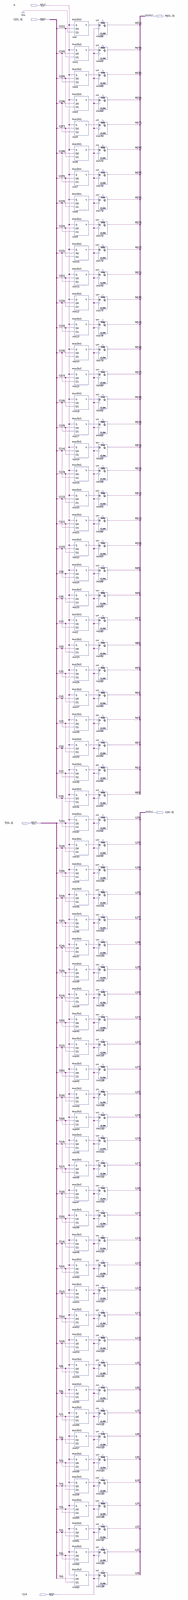
[diagram p0: schematic sheet, whole]
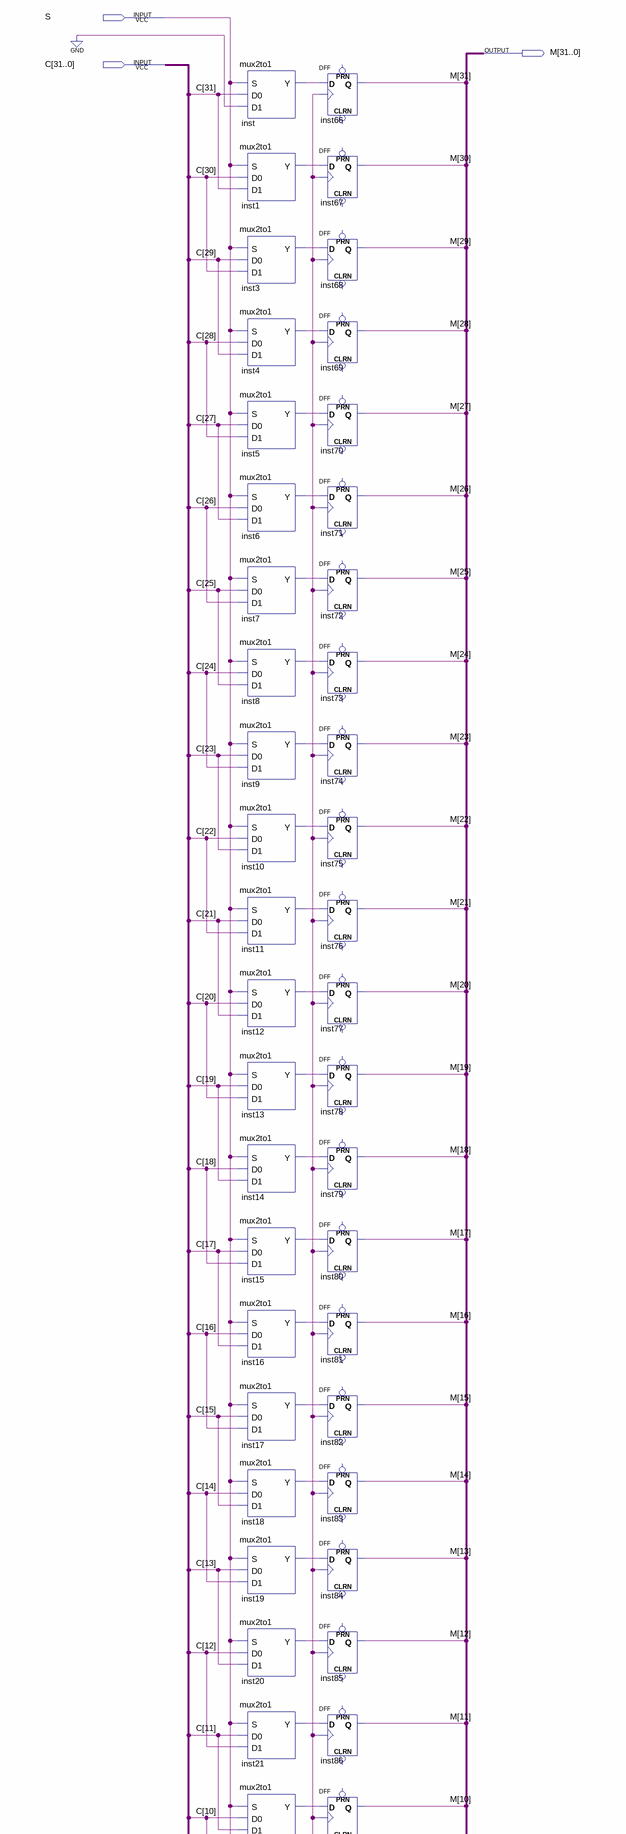
[diagram p1: schematic sheet, upper part]
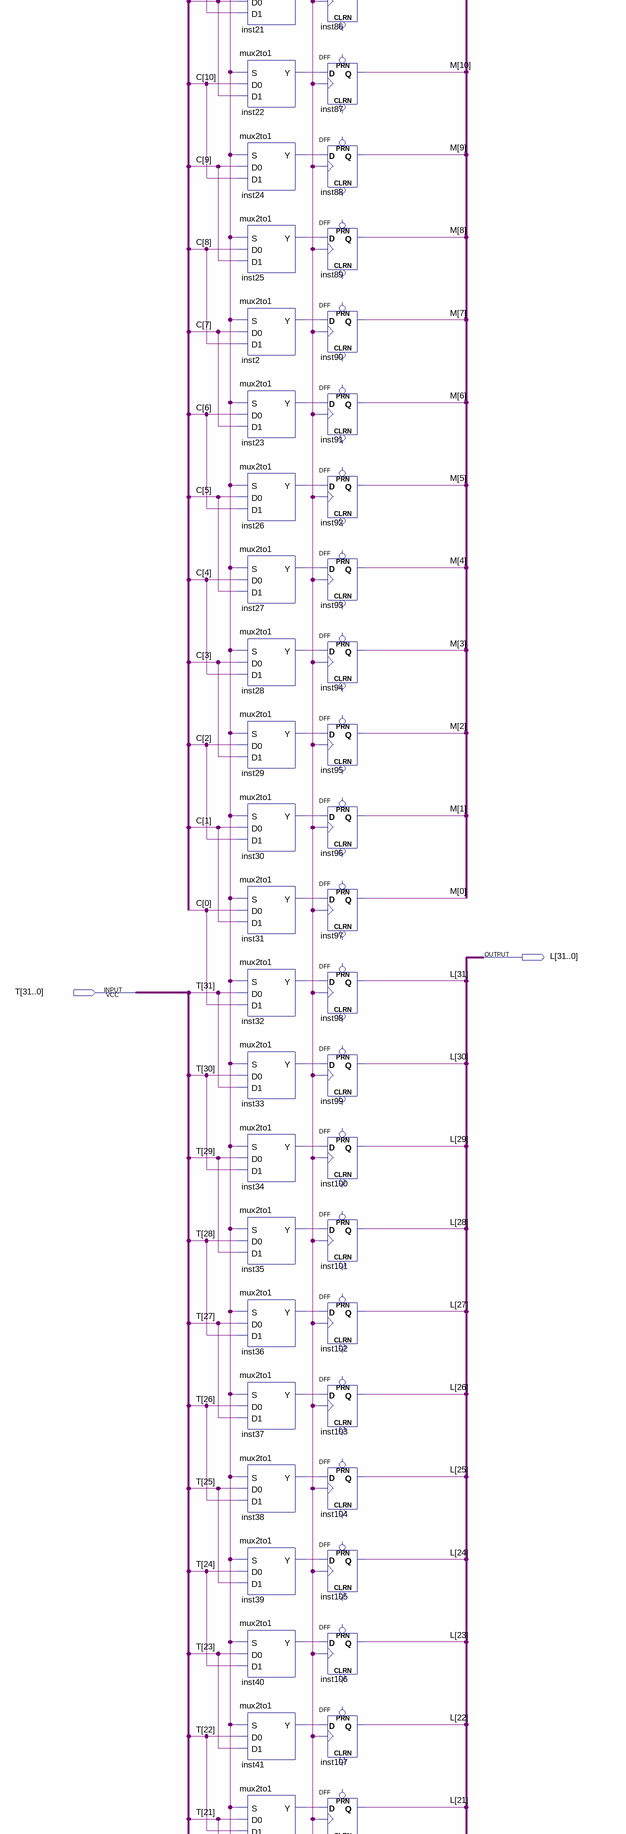
[diagram p2: schematic sheet, middle part]
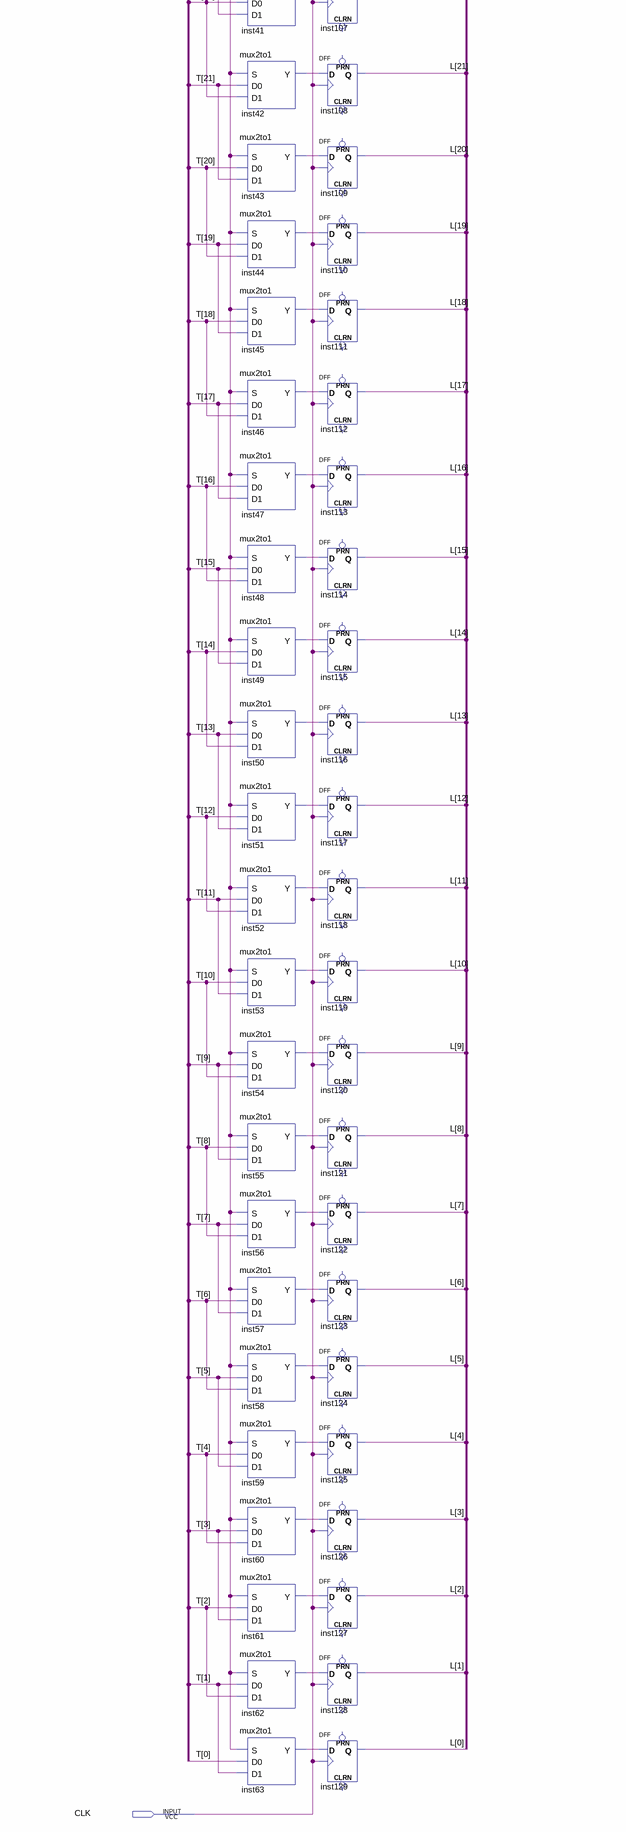
[diagram p3: schematic sheet, lower part]
// Quartus schematic Shifter.bdf as structural Verilog: 128 symbols, 6 pins
module Shifter (
  input  S,
  input  [31:0] C,
  input  [31:0] T,
  input  CLK,
  output [31:0] M,
  output [31:0] L
);

  wire inst1_y, inst2_y, inst3_y, inst4_y, inst5_y, inst6_y, inst7_y, inst8_y, inst9_y, inst10_y, inst11_y,
       inst12_y, inst13_y, inst14_y, inst15_y, inst16_y, inst17_y, inst18_y, inst19_y, inst20_y, inst21_y,
       inst22_y, inst23_y, inst24_y, inst25_y, inst26_y, inst27_y, inst28_y, inst29_y, inst30_y, inst31_y,
       inst32_y, inst33_y, inst34_y, inst35_y, inst36_y, inst37_y, inst38_y, inst39_y, inst40_y, inst41_y,
       inst42_y, inst43_y, inst44_y, inst45_y, inst46_y, inst47_y, inst48_y, inst49_y, inst50_y, inst51_y,
       inst52_y, inst53_y, inst54_y, inst55_y, inst56_y, inst57_y, inst58_y, inst59_y, inst60_y, inst61_y,
       inst62_y, inst63_y, inst_y;

  mux2to1 inst (.S(S), .D0(C[31]), .D1(1'b0), .Y(inst_y));
  mux2to1 inst1 (.S(S), .D0(C[30]), .D1(C[31]), .Y(inst1_y));
  mux2to1 inst3 (.S(S), .D0(C[29]), .D1(C[30]), .Y(inst3_y));
  mux2to1 inst4 (.S(S), .D0(C[28]), .D1(C[29]), .Y(inst4_y));
  mux2to1 inst5 (.S(S), .D0(C[27]), .D1(C[28]), .Y(inst5_y));
  mux2to1 inst6 (.S(S), .D0(C[26]), .D1(C[27]), .Y(inst6_y));
  mux2to1 inst7 (.S(S), .D0(C[25]), .D1(C[26]), .Y(inst7_y));
  mux2to1 inst8 (.S(S), .D0(C[24]), .D1(C[25]), .Y(inst8_y));
  mux2to1 inst9 (.S(S), .D0(C[23]), .D1(C[24]), .Y(inst9_y));
  mux2to1 inst10 (.S(S), .D0(C[22]), .D1(C[23]), .Y(inst10_y));
  mux2to1 inst11 (.S(S), .D0(C[21]), .D1(C[22]), .Y(inst11_y));
  mux2to1 inst12 (.S(S), .D0(C[20]), .D1(C[21]), .Y(inst12_y));
  mux2to1 inst13 (.S(S), .D0(C[19]), .D1(C[20]), .Y(inst13_y));
  mux2to1 inst14 (.S(S), .D0(C[18]), .D1(C[19]), .Y(inst14_y));
  mux2to1 inst15 (.S(S), .D0(C[17]), .D1(C[18]), .Y(inst15_y));
  mux2to1 inst16 (.S(S), .D0(C[16]), .D1(C[17]), .Y(inst16_y));
  mux2to1 inst17 (.S(S), .D0(C[15]), .D1(C[16]), .Y(inst17_y));
  mux2to1 inst18 (.S(S), .D0(C[14]), .D1(C[15]), .Y(inst18_y));
  mux2to1 inst19 (.S(S), .D0(C[13]), .D1(C[14]), .Y(inst19_y));
  mux2to1 inst20 (.S(S), .D0(C[12]), .D1(C[13]), .Y(inst20_y));
  mux2to1 inst21 (.S(S), .D0(C[11]), .D1(C[12]), .Y(inst21_y));
  mux2to1 inst22 (.S(S), .D0(C[10]), .D1(C[11]), .Y(inst22_y));
  mux2to1 inst24 (.S(S), .D0(C[9]), .D1(C[10]), .Y(inst24_y));
  mux2to1 inst25 (.S(S), .D0(C[8]), .D1(C[9]), .Y(inst25_y));
  mux2to1 inst2 (.S(S), .D0(C[7]), .D1(C[8]), .Y(inst2_y));
  mux2to1 inst23 (.S(S), .D0(C[6]), .D1(C[7]), .Y(inst23_y));
  mux2to1 inst26 (.S(S), .D0(C[5]), .D1(C[6]), .Y(inst26_y));
  mux2to1 inst27 (.S(S), .D0(C[4]), .D1(C[5]), .Y(inst27_y));
  mux2to1 inst28 (.S(S), .D0(C[3]), .D1(C[4]), .Y(inst28_y));
  mux2to1 inst29 (.S(S), .D0(C[2]), .D1(C[3]), .Y(inst29_y));
  mux2to1 inst30 (.S(S), .D0(C[1]), .D1(C[2]), .Y(inst30_y));
  mux2to1 inst31 (.S(S), .D0(C[0]), .D1(C[1]), .Y(inst31_y));
  mux2to1 inst32 (.S(S), .D0(T[31]), .D1(C[0]), .Y(inst32_y));
  mux2to1 inst33 (.S(S), .D0(T[30]), .D1(T[31]), .Y(inst33_y));
  mux2to1 inst34 (.S(S), .D0(T[29]), .D1(T[30]), .Y(inst34_y));
  mux2to1 inst35 (.S(S), .D0(T[28]), .D1(T[29]), .Y(inst35_y));
  mux2to1 inst36 (.S(S), .D0(T[27]), .D1(T[28]), .Y(inst36_y));
  mux2to1 inst37 (.S(S), .D0(T[26]), .D1(T[27]), .Y(inst37_y));
  mux2to1 inst38 (.S(S), .D0(T[25]), .D1(T[26]), .Y(inst38_y));
  mux2to1 inst39 (.S(S), .D0(T[24]), .D1(T[25]), .Y(inst39_y));
  mux2to1 inst40 (.S(S), .D0(T[23]), .D1(T[24]), .Y(inst40_y));
  mux2to1 inst41 (.S(S), .D0(T[22]), .D1(T[23]), .Y(inst41_y));
  mux2to1 inst42 (.S(S), .D0(T[21]), .D1(T[22]), .Y(inst42_y));
  mux2to1 inst43 (.S(S), .D0(T[20]), .D1(T[21]), .Y(inst43_y));
  mux2to1 inst44 (.S(S), .D0(T[19]), .D1(T[20]), .Y(inst44_y));
  mux2to1 inst45 (.S(S), .D0(T[18]), .D1(T[19]), .Y(inst45_y));
  mux2to1 inst46 (.S(S), .D0(T[17]), .D1(T[18]), .Y(inst46_y));
  mux2to1 inst47 (.S(S), .D0(T[16]), .D1(T[17]), .Y(inst47_y));
  mux2to1 inst48 (.S(S), .D0(T[15]), .D1(T[16]), .Y(inst48_y));
  mux2to1 inst49 (.S(S), .D0(T[14]), .D1(T[15]), .Y(inst49_y));
  mux2to1 inst50 (.S(S), .D0(T[13]), .D1(T[14]), .Y(inst50_y));
  mux2to1 inst51 (.S(S), .D0(T[12]), .D1(T[13]), .Y(inst51_y));
  mux2to1 inst52 (.S(S), .D0(T[11]), .D1(T[12]), .Y(inst52_y));
  mux2to1 inst53 (.S(S), .D0(T[10]), .D1(T[11]), .Y(inst53_y));
  mux2to1 inst54 (.S(S), .D0(T[9]), .D1(T[10]), .Y(inst54_y));
  mux2to1 inst55 (.S(S), .D0(T[8]), .D1(T[9]), .Y(inst55_y));
  mux2to1 inst56 (.S(S), .D0(T[7]), .D1(T[8]), .Y(inst56_y));
  mux2to1 inst57 (.S(S), .D0(T[6]), .D1(T[7]), .Y(inst57_y));
  mux2to1 inst58 (.S(S), .D0(T[5]), .D1(T[6]), .Y(inst58_y));
  mux2to1 inst59 (.S(S), .D0(T[4]), .D1(T[5]), .Y(inst59_y));
  mux2to1 inst60 (.S(S), .D0(T[3]), .D1(T[4]), .Y(inst60_y));
  mux2to1 inst61 (.S(S), .D0(T[2]), .D1(T[3]), .Y(inst61_y));
  mux2to1 inst62 (.S(S), .D0(T[1]), .D1(T[2]), .Y(inst62_y));
  mux2to1 inst63 (.S(S), .D0(T[0]), .D1(T[1]), .Y(inst63_y));
  DFF inst66 (.CLK(CLK), .D(inst_y), .Q(M[31]));  // open: CLRN, PRN
  DFF inst67 (.CLK(CLK), .D(inst1_y), .Q(M[30]));  // open: CLRN, PRN
  DFF inst68 (.CLK(CLK), .D(inst3_y), .Q(M[29]));  // open: CLRN, PRN
  DFF inst69 (.CLK(CLK), .D(inst4_y), .Q(M[28]));  // open: CLRN, PRN
  DFF inst70 (.CLK(CLK), .D(inst5_y), .Q(M[27]));  // open: CLRN, PRN
  DFF inst71 (.CLK(CLK), .D(inst6_y), .Q(M[26]));  // open: CLRN, PRN
  DFF inst72 (.CLK(CLK), .D(inst7_y), .Q(M[25]));  // open: CLRN, PRN
  DFF inst73 (.CLK(CLK), .D(inst8_y), .Q(M[24]));  // open: CLRN, PRN
  DFF inst74 (.CLK(CLK), .D(inst9_y), .Q(M[23]));  // open: CLRN, PRN
  DFF inst75 (.CLK(CLK), .D(inst10_y), .Q(M[22]));  // open: CLRN, PRN
  DFF inst76 (.CLK(CLK), .D(inst11_y), .Q(M[21]));  // open: CLRN, PRN
  DFF inst77 (.CLK(CLK), .D(inst12_y), .Q(M[20]));  // open: CLRN, PRN
  DFF inst78 (.CLK(CLK), .D(inst13_y), .Q(M[19]));  // open: CLRN, PRN
  DFF inst79 (.CLK(CLK), .D(inst14_y), .Q(M[18]));  // open: CLRN, PRN
  DFF inst80 (.CLK(CLK), .D(inst15_y), .Q(M[17]));  // open: CLRN, PRN
  DFF inst81 (.CLK(CLK), .D(inst16_y), .Q(M[16]));  // open: CLRN, PRN
  DFF inst82 (.CLK(CLK), .D(inst17_y), .Q(M[15]));  // open: CLRN, PRN
  DFF inst83 (.CLK(CLK), .D(inst18_y), .Q(M[14]));  // open: CLRN, PRN
  DFF inst84 (.CLK(CLK), .D(inst19_y), .Q(M[13]));  // open: CLRN, PRN
  DFF inst85 (.CLK(CLK), .D(inst20_y), .Q(M[12]));  // open: CLRN, PRN
  DFF inst86 (.CLK(CLK), .D(inst21_y), .Q(M[11]));  // open: CLRN, PRN
  DFF inst87 (.CLK(CLK), .D(inst22_y), .Q(M[10]));  // open: CLRN, PRN
  DFF inst88 (.CLK(CLK), .D(inst24_y), .Q(M[9]));  // open: CLRN, PRN
  DFF inst89 (.CLK(CLK), .D(inst25_y), .Q(M[8]));  // open: CLRN, PRN
  DFF inst90 (.CLK(CLK), .D(inst2_y), .Q(M[7]));  // open: CLRN, PRN
  DFF inst91 (.CLK(CLK), .D(inst23_y), .Q(M[6]));  // open: CLRN, PRN
  DFF inst92 (.CLK(CLK), .D(inst26_y), .Q(M[5]));  // open: CLRN, PRN
  DFF inst93 (.CLK(CLK), .D(inst27_y), .Q(M[4]));  // open: CLRN, PRN
  DFF inst94 (.CLK(CLK), .D(inst28_y), .Q(M[3]));  // open: CLRN, PRN
  DFF inst95 (.CLK(CLK), .D(inst29_y), .Q(M[2]));  // open: CLRN, PRN
  DFF inst96 (.CLK(CLK), .D(inst30_y), .Q(M[1]));  // open: CLRN, PRN
  DFF inst97 (.CLK(CLK), .D(inst31_y), .Q(M[0]));  // open: CLRN, PRN
  DFF inst98 (.CLK(CLK), .D(inst32_y), .Q(L[31]));  // open: CLRN, PRN
  DFF inst99 (.CLK(CLK), .D(inst33_y), .Q(L[30]));  // open: CLRN, PRN
  DFF inst100 (.CLK(CLK), .D(inst34_y), .Q(L[29]));  // open: CLRN, PRN
  DFF inst101 (.CLK(CLK), .D(inst35_y), .Q(L[28]));  // open: CLRN, PRN
  DFF inst102 (.CLK(CLK), .D(inst36_y), .Q(L[27]));  // open: CLRN, PRN
  DFF inst103 (.CLK(CLK), .D(inst37_y), .Q(L[26]));  // open: CLRN, PRN
  DFF inst104 (.CLK(CLK), .D(inst38_y), .Q(L[25]));  // open: CLRN, PRN
  DFF inst105 (.CLK(CLK), .D(inst39_y), .Q(L[24]));  // open: CLRN, PRN
  DFF inst106 (.CLK(CLK), .D(inst40_y), .Q(L[23]));  // open: CLRN, PRN
  DFF inst107 (.CLK(CLK), .D(inst41_y), .Q(L[22]));  // open: CLRN, PRN
  DFF inst108 (.CLK(CLK), .D(inst42_y), .Q(L[21]));  // open: CLRN, PRN
  DFF inst109 (.CLK(CLK), .D(inst43_y), .Q(L[20]));  // open: CLRN, PRN
  DFF inst110 (.CLK(CLK), .D(inst44_y), .Q(L[19]));  // open: CLRN, PRN
  DFF inst111 (.CLK(CLK), .D(inst45_y), .Q(L[18]));  // open: CLRN, PRN
  DFF inst112 (.CLK(CLK), .D(inst46_y), .Q(L[17]));  // open: CLRN, PRN
  DFF inst113 (.CLK(CLK), .D(inst47_y), .Q(L[16]));  // open: CLRN, PRN
  DFF inst114 (.CLK(CLK), .D(inst48_y), .Q(L[15]));  // open: CLRN, PRN
  DFF inst115 (.CLK(CLK), .D(inst49_y), .Q(L[14]));  // open: CLRN, PRN
  DFF inst116 (.CLK(CLK), .D(inst50_y), .Q(L[13]));  // open: CLRN, PRN
  DFF inst117 (.CLK(CLK), .D(inst51_y), .Q(L[12]));  // open: CLRN, PRN
  DFF inst118 (.CLK(CLK), .D(inst52_y), .Q(L[11]));  // open: CLRN, PRN
  DFF inst119 (.CLK(CLK), .D(inst53_y), .Q(L[10]));  // open: CLRN, PRN
  DFF inst120 (.CLK(CLK), .D(inst54_y), .Q(L[9]));  // open: CLRN, PRN
  DFF inst121 (.CLK(CLK), .D(inst55_y), .Q(L[8]));  // open: CLRN, PRN
  DFF inst122 (.CLK(CLK), .D(inst56_y), .Q(L[7]));  // open: CLRN, PRN
  DFF inst123 (.CLK(CLK), .D(inst57_y), .Q(L[6]));  // open: CLRN, PRN
  DFF inst124 (.CLK(CLK), .D(inst58_y), .Q(L[5]));  // open: CLRN, PRN
  DFF inst125 (.CLK(CLK), .D(inst59_y), .Q(L[4]));  // open: CLRN, PRN
  DFF inst126 (.CLK(CLK), .D(inst60_y), .Q(L[3]));  // open: CLRN, PRN
  DFF inst127 (.CLK(CLK), .D(inst61_y), .Q(L[2]));  // open: CLRN, PRN
  DFF inst128 (.CLK(CLK), .D(inst62_y), .Q(L[1]));  // open: CLRN, PRN
  DFF inst129 (.CLK(CLK), .D(inst63_y), .Q(L[0]));  // open: CLRN, PRN
endmodule
